# Altium schematic sheet LedMatrixDigit.SCHDOC
size A4
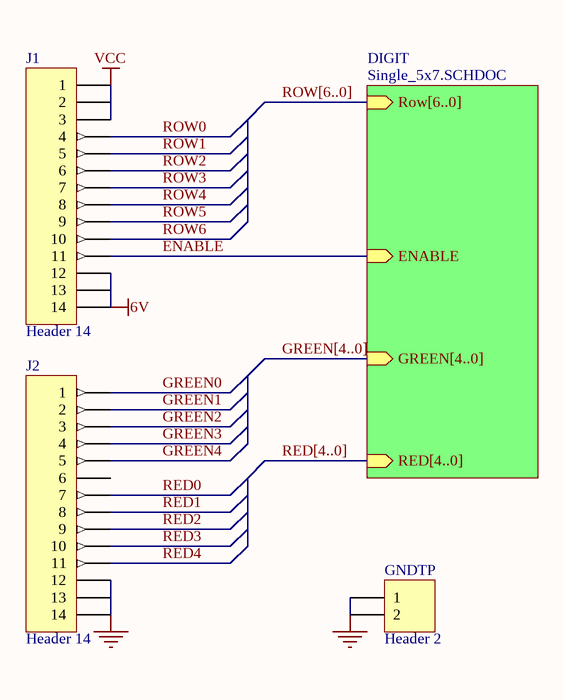
[diagram p0: LedMatrixDigit.SCHDOC]

## Parts
GNDTP  Header 2  [HDR1X2]
J1  Header 14  [HDR1X14]
J2  Header 14  [HDR1X14]

## Sub-sheets
DIGIT = Single_5x7.SCHDOC: Row[6..0] (in), ENABLE (in), GREEN[4..0] (in), RED[4..0] (in)

## Nets
6V: J1.12 J1.13 J1.14
GND: GNDTP.1 GNDTP.2 J2.12 J2.13 J2.14
VCC: J1.1 J1.2 J1.3
ENABLE: J1.11 ; sheet DIGIT/ENABLE
GREEN0: J2.1
GREEN1: J2.2
GREEN2: J2.3
GREEN3: J2.4
GREEN4: J2.5
RED0: J2.7
RED1: J2.8
RED2: J2.9
RED3: J2.10
RED4: J2.11
ROW0: J1.4
ROW1: J1.5
ROW2: J1.6
ROW3: J1.7
ROW4: J1.8
ROW5: J1.9
ROW6: J1.10

Not connected (* = marked no-connect by the designer): J2 6

## Buses and harness runs
bus GREEN[4..0] = sheet DIGIT/GREEN[4..0]
bus RED[4..0] = sheet DIGIT/RED[4..0]
bus ROW[6..0] = sheet DIGIT/Row[6..0]

## Library data of the parts
GNDTP = Header 2: Header, 2-Pin; Manufacturer: Generic Components; Class I: Connector; Fitted: True; Revision: July-2002: Re-released for DXP Platform.; Publisher: Altium Limited
J1 J2 = Header 14: Header, 14-Pin; Manufacturer: Generic Components; Class I: Connector; Revision: July-2002: Re-released for DXP Platform.; Publisher: Altium Limited